# Altium schematic sheet PWM_ABZ_MOTOR1_AND_2.SchDoc
size A4; SheetNumber: 7; SheetTotal: 10
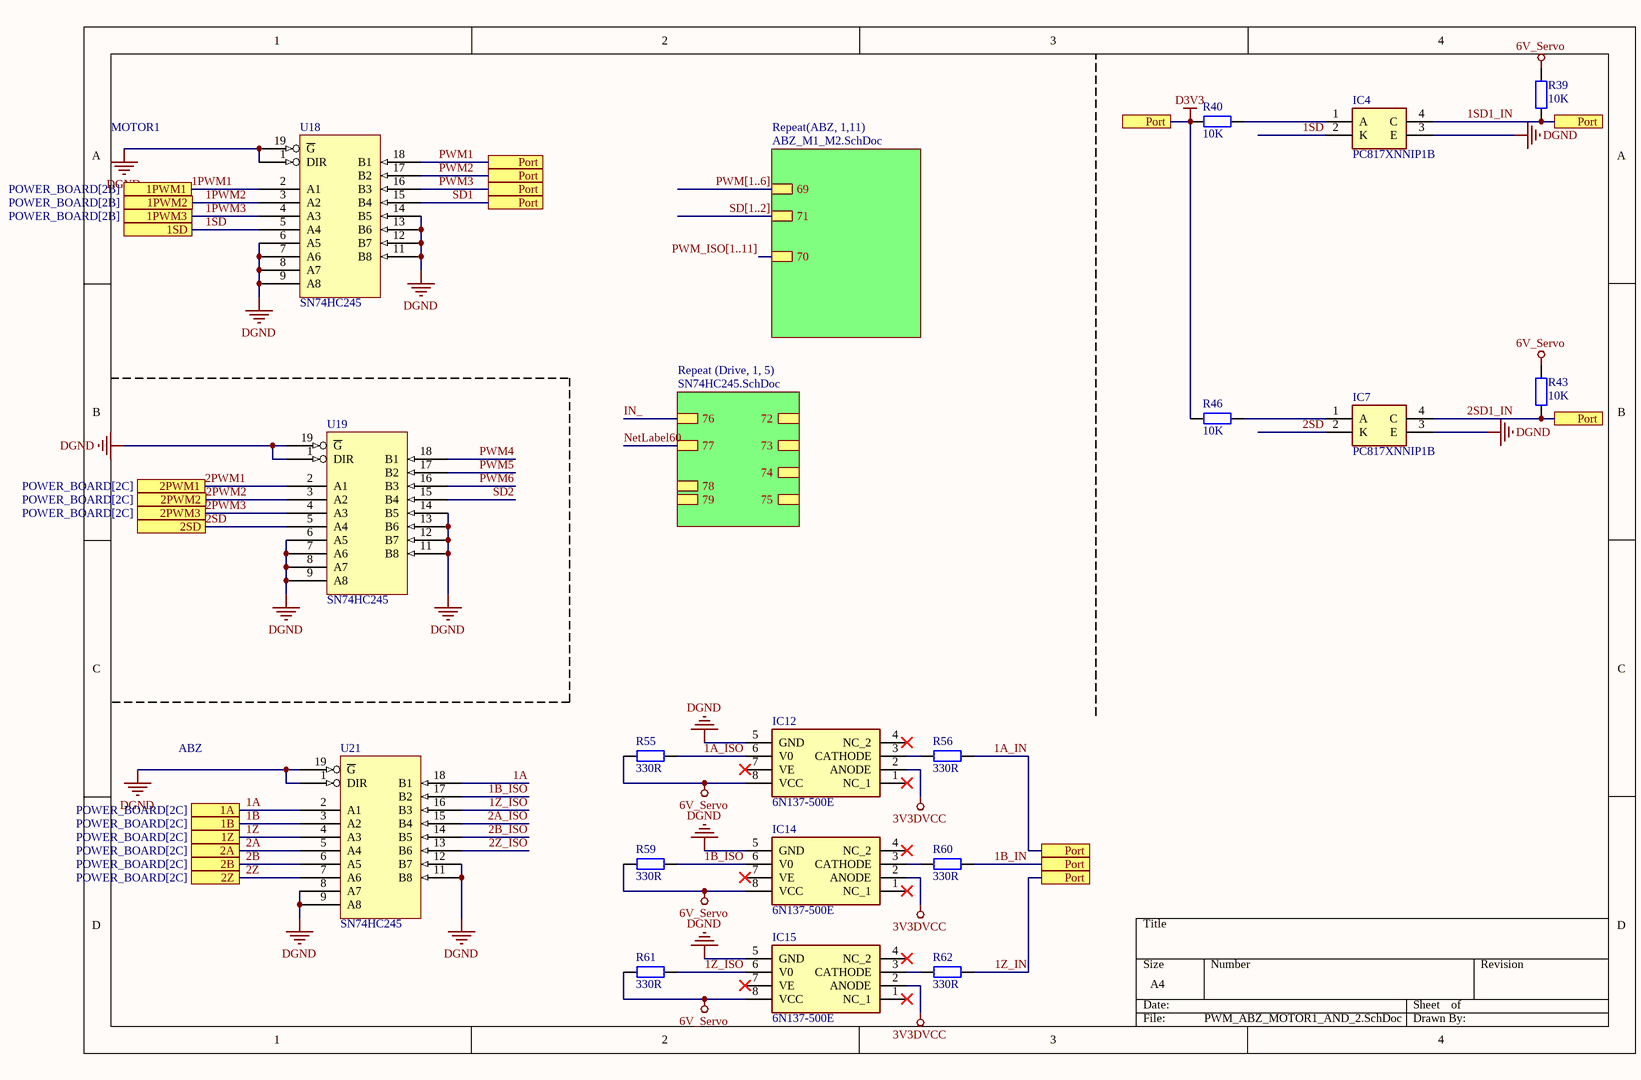
[diagram p0: PWM_ABZ_MOTOR1_AND_2.SchDoc]

## Parts
IC4  PC817XNNIP1B  [SOP254P960X420-4N]
IC7  PC817XNNIP1B  [SOP254P960X420-4N]
IC12  6N137-500E  [SOP254P1030X508-8N]
IC14  6N137-500E  [SOP254P1030X508-8N]
IC15  6N137-500E  [SOP254P1030X508-8N]
R39  10K  [R 0805_L]
R40  10K  [R 0805_L]
R43  10K  [R 0805_L]
R46  10K  [R 0805_L]
R55  330R  [R 0805_L]
R56  330R  [R 0805_L]
R59  330R  [R 0805_L]
R60  330R  [R 0805_L]
R61  330R  [R 0805_L]
R62  330R  [R 0805_L]
U18  SN74HC245  [TSSOP-20]
U19  SN74HC245  [TSSOP-20]
U21  SN74HC245  [TSSOP-20]

## Sub-sheets
Repeat (Drive, 1, 5) = SN74HC245.SchDoc: 72, 73, 74, 75, 76, 77, 78, 79
Repeat(ABZ, 1,11) = ABZ_M1_M2.SchDoc: 69, 70, 71

## Ports
1A (see POWER_BOARD[2C]), 1B (see POWER_BOARD[2C]), 1PWM1 (see POWER_BOARD[2B]), 1PWM2 (see POWER_BOARD[2B]), 1PWM3 (see POWER_BOARD[2B]), 1SD, 1Z (see POWER_BOARD[2C]), 2A (see POWER_BOARD[2C]), 2B (see POWER_BOARD[2C]), 2PWM1 (see POWER_BOARD[2C]), 2PWM2 (see POWER_BOARD[2C]), 2PWM3 (see POWER_BOARD[2C]), 2SD, 2Z (see POWER_BOARD[2C]), Port

## Nets
1A_IN: IC4.4(C) IC7.4(C) R39.1 R40.1 R43.1 R46.1 R56.1 R60.1 R62.1 U18.15(B4) U18.16(B3) U18.17(B2) U18.18(B1) ; port Port  [also labelled 1B_IN, 1SD1_IN, 1Z_IN, 2SD1_IN, D3V3, PWM1, PWM2, PWM3, SD1]
3V3DVCC: IC12.2(ANODE) IC14.2(ANODE) IC15.2(ANODE)
6V_Servo: IC12.8(VCC) IC14.8(VCC) IC15.8(VCC) R39.2 R43.2 R55.1 R59.1 R61.1
DGND: IC4.3(E) IC7.3(E) IC12.5(GND) IC14.5(GND) IC15.5(GND) U18.1(DIR) U18.6(A5) U18.7(A6) U18.8(A7) U18.9(A8) U18.11(B8) U18.12(B7) U18.13(B6) U18.14(B5) U18.19(~{G}) U19.1(DIR) U19.6(A5) U19.7(A6) U19.8(A7) U19.9(A8) U19.11(B8) U19.12(B7) U19.13(B6) U19.14(B5) U19.19(~{G}) U21.1(DIR) U21.8(A7) U21.9(A8) U21.11(B8) U21.12(B7) U21.19(~{G})
GND: U18.10(DGND) U19.10(DGND) U21.10(DGND)
VCC: U18.20(3V3DVCC) U19.20(3V3DVCC) U21.20(3V3DVCC)
1A: U21.2(A1) U21.18(B1) ; port 1A
1A_ISO: IC12.6(V0) R55.2
1B: U21.3(A2) ; port 1B
1B_ISO: IC14.6(V0) R59.2 U21.17(B2)
1PWM1: U18.2(A1) ; port 1PWM1
1PWM2: U18.3(A2) ; port 1PWM2
1PWM3: U18.4(A3) ; port 1PWM3
1SD: IC4.2(K) U18.5(A4) ; port 1SD
1Z: U21.4(A3) ; port 1Z
1Z_ISO: IC15.6(V0) R61.2 U21.16(B3)
2A: U21.5(A4) ; port 2A
2A_ISO: U21.15(B4)
2B: U21.6(A5) ; port 2B
2B_ISO: U21.14(B5)
2PWM1: U19.2(A1) ; port 2PWM1
2PWM2: U19.3(A2) ; port 2PWM2
2PWM3: U19.4(A3) ; port 2PWM3
2SD: IC7.2(K) U19.5(A4) ; port 2SD
2Z: U21.7(A6) ; port 2Z
2Z_ISO: U21.13(B6)
IN_: sheet Repeat (Drive, 1, 5)/76
NetLabel60: sheet Repeat (Drive, 1, 5)/77
PWM4: U19.18(B1)
PWM5: U19.17(B2)
PWM6: U19.16(B3)
PWM[1..6]: sheet Repeat(ABZ, 1,11)/69
PWM_ISO[1..11]: sheet Repeat(ABZ, 1,11)/70
SD2: U19.15(B4)
SD[1..2]: sheet Repeat(ABZ, 1,11)/71
NetIC4_1: IC4.1(A) R40.2
NetIC7_1: IC7.1(A) R46.2
NetIC12_3: IC12.3(CATHODE) R56.2
NetIC14_3: IC14.3(CATHODE) R60.2
NetIC15_3: IC15.3(CATHODE) R62.2

Not connected (* = marked no-connect by the designer): IC12 1(NC_1)* 4(NC_2)* 7(VE)*; IC14 1(NC_1)* 4(NC_2)* 7(VE)*; IC15 1(NC_1)* 4(NC_2)* 7(VE)*

## Notes on the sheet
- MOTOR1
- ABZ

## Library data of the parts
IC4 IC7 = PC817XNNIP1B: Phototransistor; Manufacturer_Name: Sharp Microelectronics; Datasheet Link: https://componentsearchengine.com//PC817XNNIP1B.pdf; Height: 4.2mm; Mouser2 Part Number: 852-PC817XNNIP1B; Mouser2 Price/Stock: https://www.mouser.com/Search/Refine.aspx?Keyword=852-PC817XNNIP1B; Manufacturer_Part_Number: PC817XNNIP1B
IC12 IC14 IC15 = 6N137-500E: Integrated Circuit; Manufacturer_Name: Avago Technologies; Datasheet Link: https://componentsearchengine.com//6N137-500E.pdf; Height: 4.7mm; Mouser2 Part Number: 630-6N137-500E; Mouser2 Price/Stock: https://www.mouser.com/Search/Refine.aspx?Keyword=630-6N137-500E; Manufacturer_Part_Number: 6N137-500E
R39 R40 R43 R46 R55 R56 R59-R62 = R: 贴片电阻; 版权归属: 来自淘宝 ID：黄晶宝石; 封装库来自淘宝卖家 ID：黄晶宝石: 其他店铺购入均为盗版，不享受售后技术支持服务，请立即申请退款; BOM名称: 贴片电阻; 联系售后: https://shop463601444.taobao.com
U18 U19 U21 = SN74HC245: QUAD BUS TRANSCEIVER 3SO